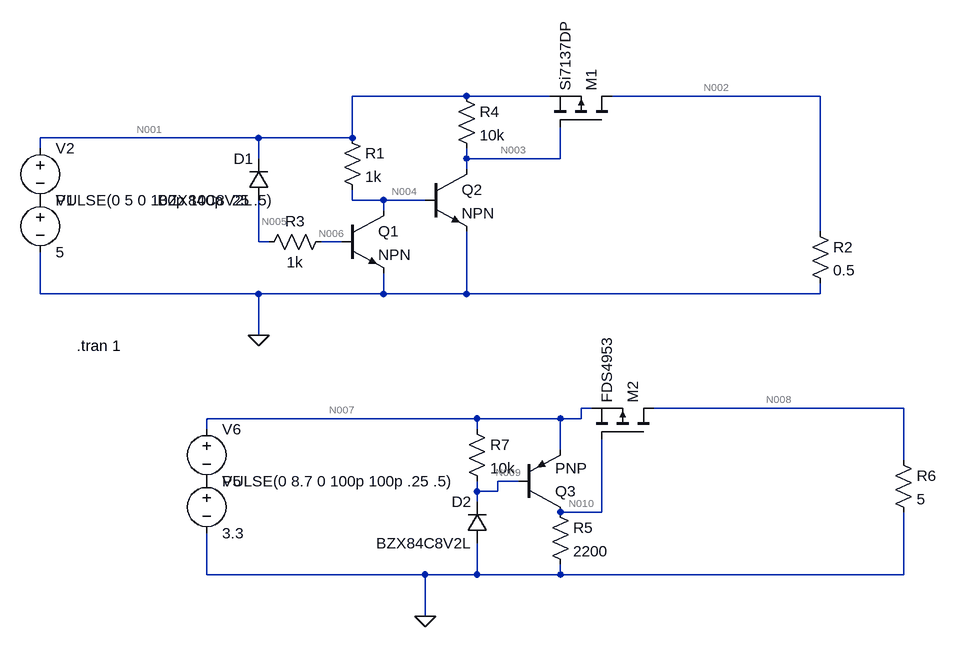
[diagram p0: schematic Draft3.asc]
Draft3.asc, the LTspice schematic file:
Version 4.1
SHEET 1 1260 800
WIRE 528 -32 352 -32
WIRE 656 -32 528 -32
WIRE 1072 -32 752 -32
WIRE 208 32 -128 32
WIRE 352 32 352 -32
WIRE 352 32 208 32
WIRE -128 48 -128 32
WIRE 208 64 208 32
WIRE 528 64 528 48
WIRE 672 64 672 16
WIRE 672 64 528 64
WIRE 528 80 528 64
WIRE 352 128 352 112
WIRE 400 128 352 128
WIRE 464 128 400 128
WIRE 400 144 400 128
WIRE 1072 176 1072 -32
WIRE 208 192 208 128
WIRE 224 192 208 192
WIRE 336 192 304 192
WIRE -128 272 -128 208
WIRE 208 272 -128 272
WIRE 400 272 400 240
WIRE 400 272 208 272
WIRE 528 272 528 176
WIRE 528 272 400 272
WIRE 1072 272 1072 256
WIRE 1072 272 528 272
WIRE 208 336 208 272
WIRE 720 448 704 448
WIRE 1200 448 816 448
WIRE 544 464 128 464
WIRE 672 464 544 464
WIRE 704 464 704 448
WIRE 704 464 672 464
WIRE 128 480 128 464
WIRE 544 480 544 464
WIRE 672 512 672 464
WIRE 1200 528 1200 448
WIRE 608 560 576 560
WIRE 544 576 544 560
WIRE 576 576 576 560
WIRE 576 576 544 576
WIRE 544 592 544 576
WIRE 736 608 736 496
WIRE 736 608 672 608
WIRE 128 704 128 640
WIRE 464 704 128 704
WIRE 544 704 544 656
WIRE 544 704 464 704
WIRE 672 704 672 688
WIRE 672 704 544 704
WIRE 1200 704 1200 608
WIRE 1200 704 672 704
WIRE 464 768 464 704
FLAG 208 336 0
FLAG 464 768 0
SYMBOL res 1056 160 R0
SYMATTR InstName R2
SYMATTR Value 0.5
SYMBOL voltage -128 112 R0
WINDOW 123 0 0 Left 0
WINDOW 39 0 0 Left 0
SYMATTR InstName V1
SYMATTR Value 5
SYMBOL voltage -128 32 R0
WINDOW 123 0 0 Left 0
WINDOW 39 0 0 Left 0
SYMATTR InstName V2
SYMATTR Value PULSE(0 5 0 100p 100p .25 .5)
SYMBOL res 336 16 R0
SYMATTR InstName R1
SYMATTR Value 1k
SYMBOL npn 336 144 R0
SYMATTR InstName Q1
SYMBOL diode 224 128 R180
WINDOW 0 24 64 Left 2
WINDOW 3 24 0 Left 2
SYMATTR InstName D1
SYMATTR Value BZX84C8V2L
SYMBOL res 320 176 R90
WINDOW 0 0 56 VBottom 2
WINDOW 3 32 56 VTop 2
SYMATTR InstName R3
SYMATTR Value 1k
SYMBOL npn 464 80 R0
SYMATTR InstName Q2
SYMBOL res 512 -48 R0
SYMATTR InstName R4
SYMATTR Value 10k
SYMBOL pmos 752 16 M270
SYMATTR InstName M1
SYMATTR Value Si7137DP
SYMBOL voltage 128 544 R0
WINDOW 123 0 0 Left 0
WINDOW 39 0 0 Left 0
SYMATTR InstName V5
SYMATTR Value 3.3
SYMBOL voltage 128 464 R0
WINDOW 123 0 0 Left 0
WINDOW 39 0 0 Left 0
SYMATTR InstName V6
SYMATTR Value PULSE(0 8.7 0 100p 100p .25 .5)
SYMBOL res 1184 512 R0
SYMATTR InstName R6
SYMATTR Value 5
SYMBOL pnp 608 608 M180
SYMATTR InstName Q3
SYMBOL diode 560 656 R180
WINDOW 0 24 64 Left 2
WINDOW 3 24 0 Left 2
SYMATTR InstName D2
SYMATTR Value BZX84C8V2L
SYMBOL res 656 592 R0
SYMATTR InstName R5
SYMATTR Value 2200
SYMBOL res 528 464 R0
SYMATTR InstName R7
SYMATTR Value 10k
SYMBOL pmos 816 496 M270
SYMATTR InstName M2
SYMATTR Value FDS4953
TEXT -72 352 Left 2 !.tran 1

The netlist it stands for:
* Draft3.asc
R2 N002 0 0.5
V1 P001 0 5
V2 N001 P001 PULSE(0 5 0 100p 100p .25 .5)
R1 N001 N004 1k
Q1 N004 N006 0 0 NPN
D1 N005 N001 BZX84C8V2L
R3 N006 N005 1k
Q2 N003 N004 0 0 NPN
R4 N001 N003 10k
M1 N002 N003 N001 N001 Si7137DP
V5 P002 0 3.3
V6 N007 P002 PULSE(0 8.7 0 100p 100p .25 .5)
R6 N008 0 5
Q3 N010 N009 N007 0 PNP
D2 0 N009 BZX84C8V2L
R5 N010 0 2200
R7 N007 N009 10k
M2 N008 N010 N007 N007 FDS4953
.model D D
.lib standard.dio
.model NPN NPN
.model PNP PNP
.lib standard.bjt
.model NMOS NMOS
.model PMOS PMOS
.lib standard.mos
.tran 1
.backanno
.end

* Results of the author's LTspice run, read from the files saved beside the schematic
* Operating Point, zero values left out:
*   V(p001) = 5 V
*   V(n004) = 830.1 mV
*   V(n006) = 530.4 mV
*   V(n003) = 19.46 mV
*   V(n008) = 3.225 V
*   V(n009) = 3.3 V
*   V(n002) = 4.981 V
*   V(n001) = 5 V
*   V(n005) = 530.4 mV
*   V(p002) = 3.3 V
*   V(n007) = 3.3 V
*   V(n010) = 7.26 nV
*   I(R2) = 9.962 A
*   Ic(Q1) = 80.42 nA
*   Ib(Q1) = 804.5 pA
*   Ie(Q1) = -81.23 nA
*   Ic(Q2) = 498.1 µA
*   Ib(Q2) = 4.17 mA
*   Ie(Q2) = -4.668 mA
*   I(V5) = -645.1 mA
*   I(R6) = 645.1 mA
*   I(R5) = 3.3 pA
*   I(V2) = -9.967 A
*   I(D1) = -804.5 pA
*   Ic(Q3) = -3.3 pA
*   Ib(Q3) = 3.3 pA
*   I(V1) = -9.967 A
*   I(R3) = -804.5 pA
*   I(R4) = 498.1 µA
*   Id(M1) = -9.962 A
*   Is(M1) = 9.962 A
*   I(R7) = 806.6 pA
*   I(R1) = 4.17 mA
*   I(V6) = -645.1 mA
*   I(D2) = -803.3 pA
*   Id(M2) = -645.1 mA
*   Is(M2) = 645.1 mA
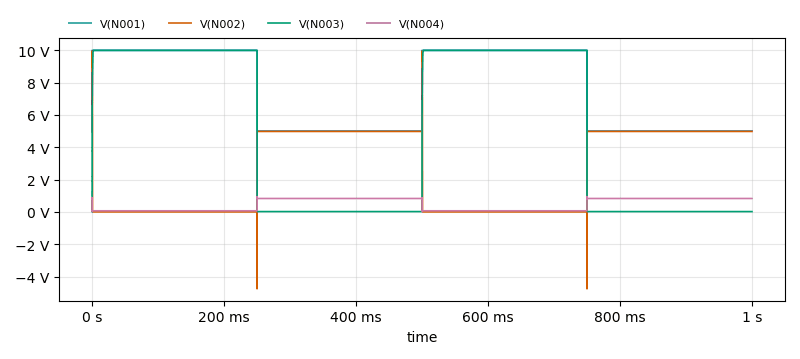
[diagram p1: Transient Analysis of Draft3.asc, plotted from the saved traces]
* Transient Analysis, 1 run:
*   V(N001): min 5 V, max 10 V, average 7.5 V, rms 7.906 V, last 5 V
*   V(N002): min -4.761 V, max 9.963 V, average 2.501 V, rms 3.536 V, last 4.981 V
*   V(N003): min 19.46 mV, max 10 V, average 5.006 V, rms 7.066 V, last 19.46 mV
*   V(N004): min 37.25 mV, max 946.9 mV, average 448.9 mV, rms 588.9 mV, last 830.1 mV